# Altium schematic sheet Forced Oscillations ExperimentV2.SchDoc: Forced Oscillation Experiment
size A3; PageSetup: Record=PageOptions|CenterHorizontal=True|CenterVertical=True|PrintScale=0.95|XCorrection=1.00|YCorrection=1.00|PrintKind=0|BorderSize=5000000|LeftOffset=0|BottomOffset=0|Orientation=2|PaperLength=1000|PaperWidth=1000|Scale=100|PaperSource=7|PrintQuality=-3|MediaType=1|DitherType=10|PrintScaleMode=1|PaperKind=11×17|PaperIndex=17; Organization: Electronics Section; Address1: The University of Manchester; Address2: School of Chemistry; Address3: Tel. 0161 275 4641; Address4: RM 2.318; Revision: 3; SheetNumber: 1; SheetTotal: 2; FR: 1260; JobNo: 3266
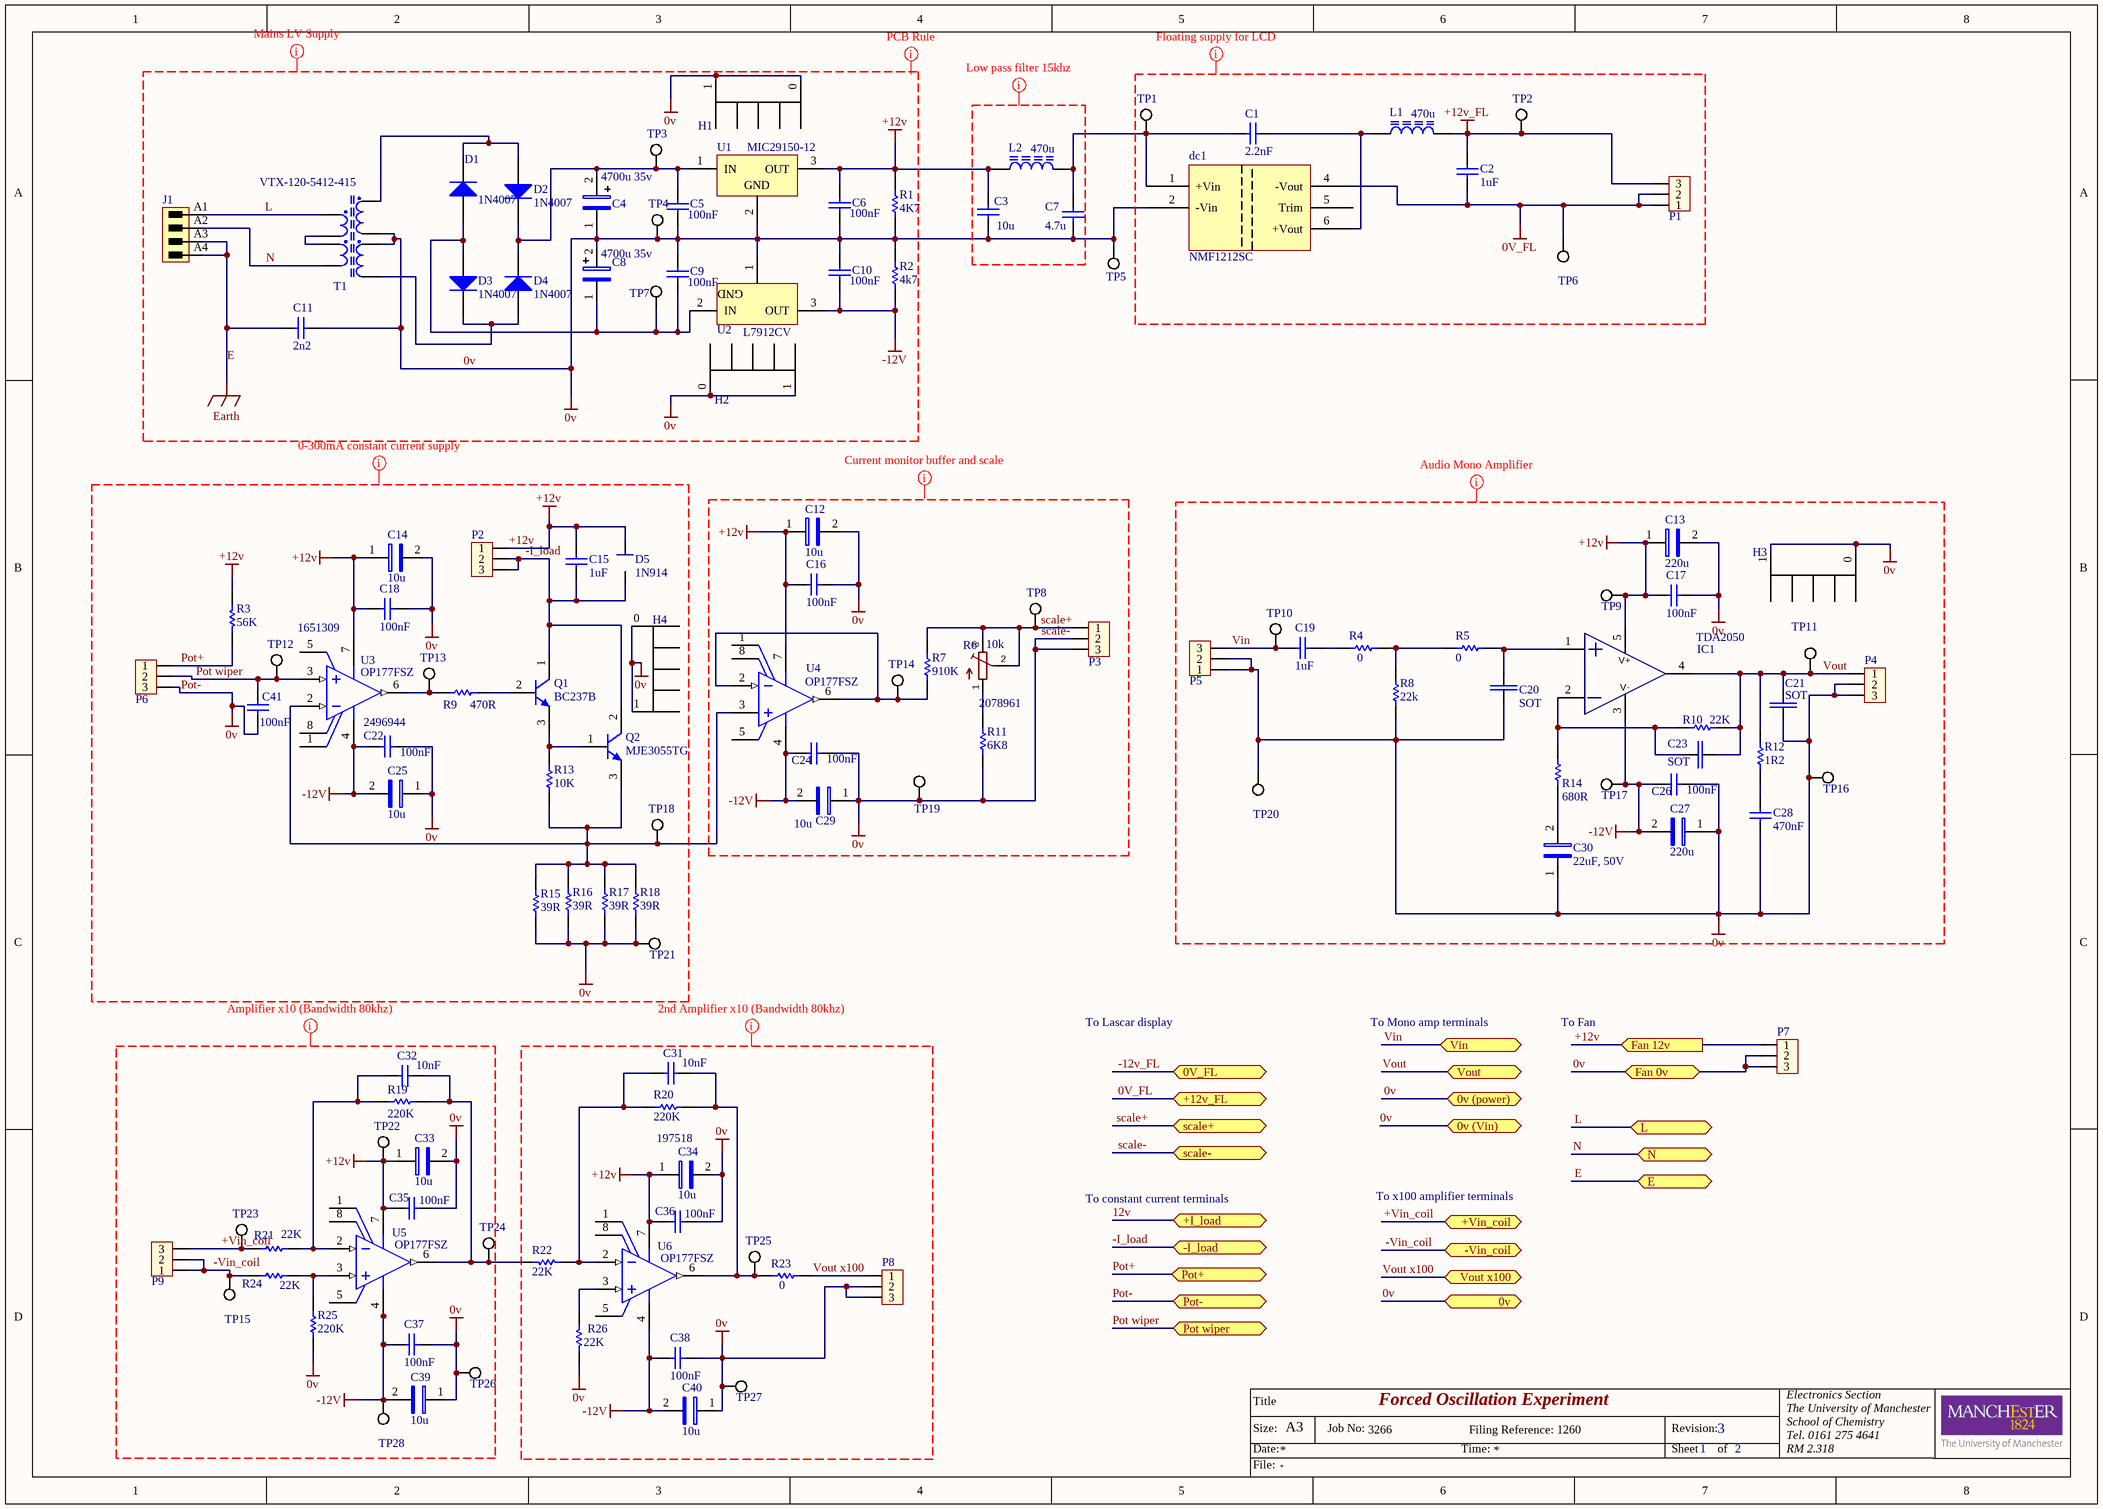
[diagram p0: Forced Oscillations ExperimentV2.SchDoc]

## Parts
C1  2.2nF  [CAPC0805(2012)100_N]
C2  1uF  [CAPC0805(2012)100_N]
C3  10u  [CAPC0805(2012)145_L]
C4  4700u 35v  [MCLPR_35v]
C5  100nF  [CAPC0805(2012)100_M]
C6  100nF  [CAPC0805(2012)100_M]
C7  4.7u  [CAPC0805(2012)145_L]
C8  4700u 35v  [MCLPR_35v]
C9  100nF  [CAPC0805(2012)100_M]
C10  100nF  [CAPC0805(2012)100_M]
C11  2n2  [RAD-0.3]
C12  value 10u  [Cap_pol_2312_6032]  (hidden comment: Tant_2312_6032)
C13  220u  [Electrolytic size F]
C14  value 10u  [Cap_pol_2312_6032]  (hidden comment: Tant_2312_6032)
C15  1uF  [CAPC0805(2012)100_N]
C16  100nF  [CAPC0805(2012)100_M]
C17  100nF  [CAPC0805(2012)100_M]
C18  100nF  [CAPC0805(2012)100_M]
C19  1uF  [CAPC0805(2012)100_N]
C20  SOT  [SOT_ceramic_0805]
C21  SOT  [SOT_ceramic_0805]
C22  Supplier Part Number 1: 2496944  [CAPC0805(2012)100_M]  (hidden comment: 100nF)
C23  SOT  [SOT_ceramic_0805]
C24  100nF  [CAPC0805(2012)100_M]
C25  value 10u  [Cap_pol_2312_6032]  (hidden comment: Tant_2312_6032)
C26  100nF  [CAPC0805(2012)100_M]
C27  220u  [Electrolytic size F]
C28  470nF  [CAPC0805(2012)100_N]
C29  value 10u  [Cap_pol_2312_6032]  (hidden comment: Tant_2312_6032)
C30  22uF, 50V  [PANASONIC, Size D]
C31  10nF  [CAPC0805(2012)100_L]
C32  10nF  [CAPC0805(2012)100_L]
C33  value 10u  [Cap_pol_2312_6032]  (hidden comment: Tant_2312_6032)
C34  value 10u  Supplier Part Number 1: 197518  [Cap_pol_2312_6032]  (hidden comment: Tant_2312_6032)
C35  100nF  [CAPC0805(2012)100_M]
C36  100nF  [CAPC0805(2012)100_M]
C37  100nF  [CAPC0805(2012)100_M]
C38  100nF  [CAPC0805(2012)100_M]
C39  value 10u  [Cap_pol_2312_6032]  (hidden comment: Tant_2312_6032)
C40  value 10u  [Cap_pol_2312_6032]  (hidden comment: Tant_2312_6032)
C41  100nF  [CAPC0805(2012)100_M]
D1  1N4007  [DO-41]
D2  1N4007  [DO-41]
D3  1N4007  [DO-41]
D4  1N4007  [DO-41]
D5  1N914  [RB551V-30TE-17]
dc1  NMF1212SC  [NMFXXXXSC]
H1  sk 76 50 sts to 220  [sk76-50-to220]  (value not drawn)
H2  sk 76 50 sts to 220  [sk76-50-to220]  (value not drawn)
H3  Heatsink 2  [1.25gy-50]  (value not drawn)
H4  sk 76 50 sts to 220  [sk76-50-to220]  (value not drawn)
IC1  TDA2050  [TDA2050_Vertical_Pentawatt]
J1  1147360000  [SL_5_08HC_180B_04]  (value not drawn)
L1  470u  [Multi-Size]
L2  470u  [Multi-Size]
P1  Molex KK 0.1  3pin  [Molex KK 0.1 3pin]  (value not drawn)
P2  Molex KK 0.1  3pin  [Molex KK 0.1 3pin]  (value not drawn)
P3  Molex KK 0.1  3pin  [Molex KK 0.1 3pin]  (value not drawn)
P4  Molex KK 0.1  3pin  [Molex KK 0.1 3pin]  (value not drawn)
P5  Molex KK 0.1  3pin  [Molex KK 0.1 3pin]  (value not drawn)
P6  Molex KK 0.1  3pin  [Molex KK 0.1 3pin]  (value not drawn)
P7  Molex KK 0.1  3pin  [Molex KK 0.1 3pin]  (value not drawn)
P8  Molex KK 0.1  3pin  [Molex KK 0.1 3pin]  (value not drawn)
P9  Molex KK 0.1  3pin  [Molex KK 0.1 3pin]  (value not drawn)
Q1  BC237B  [ONSC-TO-92-3-29-11]
Q2  MJE3055TG  [ONSC-TO-220-3-221A-09]
R1  4K7  [RESC0805(2012)_M]
R2  4k7  [RESC0805(2012)_M]
R3  56K  [RESC0805(2012)_L]
R4  0  [RESC0805(2012)_N]
R5  0  [RESC0805(2012)_N]
R6  10k  [3269w]
R7  910K  [RESC0805(2012)_L]
R8  22k  [RESC0805(2012)_N]
R9  470R  [RESC0805(2012)_M]
R10  22K  [RESC0805(2012)_N]
R11  6K8  Supplier Part Number 1: 2078961  [RESC0805(2012)_L]
R12  1R2  [RESC2512(6432)_M]
R13  10K  [RESC0805(2012)_M]
R14  680R  [RESC0805(2012)_L]
R15  39R  [RESC2512(6432)_M]
R16  39R  [RESC2512(6432)_M]
R17  39R  [RESC2512(6432)_M]
R18  39R  [RESC2512(6432)_M]
R19  220K  [RESC0805(2012)_N]
R20  220K  [RESC0805(2012)_N]
R21  22K  [RESC0805(2012)_N]
R22  22K  [RESC0805(2012)_N]
R23  0  [RESC0805(2012)_N]
R24  22K  [RESC0805(2012)_N]
R25  220K  [RESC0805(2012)_N]
R26  22K  [RESC0805(2012)_N]
T1  VTX-120-5412-415  [VTX-120-5412-415]
TP1  Test Point  [S1751-46R]  (value not drawn)
TP2  Test Point  [S1751-46R]  (value not drawn)
TP3  Test Point  [S1751-46R]  (value not drawn)
TP4  Test Point  [S1751-46R]  (value not drawn)
TP5  Test Point  [S1751-46R]  (value not drawn)
TP6  Test Point  [S1751-46R]  (value not drawn)
TP7  Test Point  [S1751-46R]  (value not drawn)
TP8  Test Point  [S1751-46R]  (value not drawn)
TP9  Test Point  [S1751-46R]  (value not drawn)
TP10  Test Point  [S1751-46R]  (value not drawn)
TP11  Test Point  [S1751-46R]  (value not drawn)
TP12  Test Point  [S1751-46R]  (value not drawn)
TP13  Test Point  [S1751-46R]  (value not drawn)
TP14  Test Point  [S1751-46R]  (value not drawn)
TP15  Test Point  [S1751-46R]  (value not drawn)
TP16  Test Point  [S1751-46R]  (value not drawn)
TP17  Test Point  [S1751-46R]  (value not drawn)
TP18  Test Point  [S1751-46R]  (value not drawn)
TP19  Test Point  [S1751-46R]  (value not drawn)
TP20  Test Point  [S1751-46R]  (value not drawn)
TP21  Test Point  [S1751-46R]  (value not drawn)
TP22  Test Point  [S1751-46R]  (value not drawn)
TP23  Test Point  [S1751-46R]  (value not drawn)
TP24  Test Point  [S1751-46R]  (value not drawn)
TP25  Test Point  [S1751-46R]  (value not drawn)
TP26  Test Point  [S1751-46R]  (value not drawn)
TP27  Test Point  [S1751-46R]  (value not drawn)
TP28  Test Point  [S1751-46R]  (value not drawn)
U1  MIC29150-12  [TO220]
U2  L7912CV  [TO-220]
U3  OP177FSZ  Supplier Part Number 1: 1651309  [ADI-R-8_N]
U4  OP177FSZ  [ADI-R-8_N]
U5  OP177FSZ  [ADI-R-8_N]
U6  OP177FSZ  [ADI-R-8_N]

## Ports
0v, 0v (power) (bidir), 0v (Vin) (bidir), 0V_FL (bidir), +12v_FL (bidir), +I_load, +Vin_coil, -I_load, -Vin_coil, E (bidir), Fan 0v (bidir), Fan 12v (in), L (bidir), N (bidir), Pot wiper, Pot+, Pot-, scale+ (bidir), scale- (bidir), Vin (bidir), Vout (bidir), Vout x100

## Nets
0v: C3.2 C4.1 C5.2 C6.2 C7.2 C8.2 C9.1 C10.1 C11.2 C12.2 C13.2 C14.2 C16.1 C17.1 C18.1 C20.1 C21.1 C22.1 C24.1 C25.1 C26.1 C27.1 C28.2 C29.1 C30.1 C33.2 C34.2 C35.1 C36.1 C37.1 C38.1 C39.1 C40.1 C41.2 dc1.2(-Vin) H1.0 H1.1 H2.0 H2.1 H3.0 H3.1 H4.0 H4.1 P3.2 P3.3 P4.2 P4.3 P5.1 P5.2 P6.3 P7.2 P7.3 P8.2 P8.3 R1.2 R2.1 R8.2 R11.1 R15.2 R16.2 R17.2 R18.2 R25.2 R26.1 T1.6 T1.7 TP4.1 TP5.1 TP16.1 TP19.1 TP20.1 TP21.1 TP26.1 TP27.1 U1.2(GND) U2.1(GND) ; port 0v, port scale-, port Pot-, port 0v (power), port 0v (Vin), port Fan 0v  [also labelled Pot-, scale-]
0V_FL: C2.2 dc1.4(-Vout) P1.1 P1.2 TP6.1 ; port +12v_FL
+12v: C3.1 C6.1 C12.1 C13.1 C14.1 C15.1 C16.2 C17.2 C18.2 C33.1 C34.1 C35.2 C36.2 D5.1 IC1.5(VCC) L2.1 P2.1 P7.1 R1.1 R3.2 TP9.1 TP22.1 U1.3(OUT) U3.7(V+) U4.7(V+) U5.7(V+) U6.7(V+) ; port Fan 12v
+12v_FL: C2.1 L1.2 P1.3 TP2.1
-12V: C10.2 C22.2 C24.2 C25.2 C26.2 C27.2 C29.2 C37.2 C38.2 C39.2 C40.2 IC1.3(V-) R2.2 TP17.1 TP28.1 U2.3(OUT) U3.4(V-) U4.4(V-) U5.4(V-) U6.4(V-)
E: C11.1 J1.A3 J1.A4 ; port E  [also labelled Earth]
12v: port +I_load
+Vin_coil: P9.3 R21.1 TP23.1 ; port +Vin_coil
-12v_FL: port 0V_FL
-I_load: C15.2 D5.2 P2.2 P2.3 Q1.1(C) Q2.2(C) ; port -I_load
-Vin_coil: P9.1 P9.2 R24.1 TP15.1 ; port -Vin_coil
L: J1.A1 T1.1(0v) ; port L
N: J1.A2 T1.4 ; port N
Pot wiper: C41.1 P6.2 TP12.1 U3.3(+IN) ; port Pot wiper
Pot+: P6.1 R3.1 ; port Pot+
scale+: P3.1 R6.2(S) R6.3(E) R7.1 TP8.1 ; port scale+
Vin: C19.1 P5.3 TP10.1 ; port Vin
Vout: C21.2 C23.2 IC1.4(OUT) P4.1 R10.2 R12.2 TP11.1 ; port Vout
Vout x100: P8.1 R23.2 ; port Vout x100
NetC1_1: C1.1 C7.1 dc1.1(+Vin) L2.2 TP1.1
NetC1_2: C1.2 dc1.6(+Vout) L1.1
NetC4_2: C4.2 C5.1 D2.2(K) D4.2(K) TP3.1 U1.1(IN)
NetC8_1: C8.1 C9.2 D1.1(A) D3.1(A) TP7.1 U2.2(IN)
NetC19_2: C19.2 R4.1
NetC20_2: C20.2 IC1.1(IN+) R5.2
NetC23_1: C23.1 IC1.2(IN-) R10.1 R14.1
NetC28_1: C28.1 R12.1
NetC30_2: C30.2 R14.2
NetC31_1: C31.1 R20.2 R22.2 U6.2(-IN)
NetC31_2: C31.2 R20.1 R23.1 TP25.1 U6.6(OUT)
NetC32_1: C32.1 R19.2 R21.2 U5.2(-IN)
NetC32_2: C32.2 R19.1 R22.1 TP24.1 U5.6(OUT)
NetD1_2: D1.2(K) D2.1(A) T1.5
NetD3_2: D3.2(K) D4.1(A) T1.8
NetQ1_2: Q1.2(B) R9.2
NetQ1_3: Q1.3(E) Q2.1(B) R13.1
NetQ2_3: Q2.3(E) R13.2 R15.1 R16.1 R17.1 R18.1 TP18.1 U3.2(-IN) U4.3(+IN)
NetR4_2: R4.2 R5.1 R8.1
NetR6_1: R6.1(A) R11.2
NetR7_2: R7.2 TP14.1 U4.2(-IN) U4.6(OUT)
NetR9_1: R9.1 TP13.1 U3.6(OUT)
NetR24_2: R24.2 R25.1 U5.3(+IN)
NetR26_2: R26.2 U6.3(+IN)
NetT1_2: T1.2(Vpri) T1.3

Not connected (* = marked no-connect by the designer): dc1 5(Trim); U3 1(VOS_TRIM) 5(NC) 8(VOS_TRIM); U4 1(VOS_TRIM) 5(NC) 8(VOS_TRIM); U5 1(VOS_TRIM) 5(NC) 8(VOS_TRIM); U6 1(VOS_TRIM) 5(NC) 8(VOS_TRIM)

## Layout directives
net class Low pass filter 15khz: (no net found under the mark)
net class Undefined: 0V_FL, +12v_FL
net class Constant current Supply: 0v, +12v, -12V, -I_load, Pot wiper, Pot+, Pot-
net class Current buffer: 0v, +12v, -12V, scale+, scale-
net class x100 amplifier (1): 0v, +12v, +Vin_coil, -12V, -Vin_coil
net class x100 amp (2): 0v, +12v, -12V, Vout x100
net class Mono Amplifier: 0v, +12v, -12V, Vin, Vout
net class Mains LV: 0v, +12v, -12V, E, Earth, L, N
rule Width Constraint [Pref Width = 4mm    Min Width = 0.5mm    Max Width = 5mm]: 0v, +12v, -12V, E, Earth, L, N

## Notes on the sheet
- To Lascar display
- To Mono amp terminals
- To Fan
- To constant current terminals
- To x100 amplifier terminals
- Title
- Size:
- Date:
- A3
- Job No:
- Time:
- Filing Reference:
- Revision:
- Sheet
- of
- File:
- (in symbol TDA2050) V+

## Library data of the parts
C1 = CMP-1036-03249-1: CAP 2.2nF 25V ±1% 0805 (2012 Metric) Thickness 1mm SMD; Case-EIA: 0805; Case-Metric: 2012; Tolerance: Â±1%; Rated Voltage: 25 V; Technology: SMT; Max Thickness: 1 mm; Value: 2.2nF; ClassName: Floating supply; Supplier 1: Farnell; Supplier Part Number 1: 2280664
C2 C15 C19 = CMP-1036-04756-1: CAP 1uF 25V ±20% 0805 (2012 Metric) Thickness 1mm SMD; Case-Metric: 2012; Case-EIA: 0805; Tolerance: Â±20%; Max Thickness: 1 mm; Technology: SMT; Value: 1uF; Rated Voltage: 25 V; Supplier 1: Farnell; Supplier Part Number 1: 2496944
  C2 C15: ClassName: Constant current
  C19: ClassName: Power Amp
C3 = CMP-1036-04703-1: Case-EIA: 0805; Tolerance: Â±5%; Value: 10uf; Rated Voltage: 50 V; Case-Metric: 2012; Technology: SMT; Max Thickness: 1.45 mm; ClassName: lowpass filter; Supplier 1: Farnell; Supplier Part Number 1: 1867958
C4 C8 = MCLPR35V478M22x30: Supplier 1: Farnell; Supplier Part Number 1: 9452842; ClassName: Mains LV Supply
C5 C6 C9 C10 C16 C18 C22 C24 C26 C35-C38 C41 = CMP-1036-04409-1: Case-EIA: 0805; Case-Metric: 2012; Rated Voltage: 25 V; Tolerance: Â±5%; 2496944: Farnell; Max Thickness: 1 mm; Value: 100nF; Technology: SMT; Supplier 1: Farnell
  C5 C6 C9 C10: ClassName: Mains LV Supply; Supplier Part Number 1: 2496944
  C16 C24: ClassName: LCD Buffer; Supplier Part Number 1: 2496944
  C18: ClassName: Constant current; Supplier Part Number 1: 2496944
  C22: ClassName: Constant current
  C26: ClassName: Power Amp; Supplier Part Number 1: 2496944
  C35 C37 C41: ClassName: stage 1 amp; Supplier Part Number 1: 2496944
  C36 C38: ClassName: Stage 2 amp; Supplier Part Number 1: 2496944
C7 = CMP-1036-04703-1: Case-EIA: 0805; Tolerance: Â±5%; Value: 4.7uf; Rated Voltage: 50 V; Case-Metric: 2012; Technology: SMT; Max Thickness: 1.45 mm; ClassName: lowpass filter; Supplier 1: Farnell; Supplier Part Number 1: 2672194
C11 = Cap: Capacitor; Published: 8-Jun-2000; LatestRevisionDate: 17-Jul-2002; LatestRevisionNote: Re-released for DXP Platform.; PackageReference: RAD-0.3; Publisher: Altium Limited; PackageDescription: Radial Cap, Thru-Hole; 2 Leads; 0.3 in Pin Spacing; Supplier 1: Farnell; Supplier Part Number 1: 1609515
C13 C27 = Panasonic_size F8: Supplier 1: Farnell; Supplier Part Number 1: 2326216; ClassName: Power Amp
C17 = CMP-1036-04409-1: Case-EIA: 0805; Case-Metric: 2012; Rated Voltage: 100V; Tolerance: Â±5%; 2496944: Farnell; Max Thickness: 1 mm; Value: 100nF; Technology: SMT; ClassName: Power Amp; Supplier 1: Farnell; Supplier Part Number 1: 2496944
C20 C21 C23 = SOT_Ceramic: Value: SOT
C28 = CMP-1036-04644-1: CAP 470nF; Case-EIA: 0805; Tolerance: Â±5%; Rated Voltage: 25 V; Case-Metric: 2012; Value: 470nF; Technology: SMT; Max Thickness: 1 mm; ClassName: Power Amp; Supplier 1: Farnell; Supplier Part Number 1: 1288281
C30 = 22uF_50V: Supplier 1: Farnell; Supplier Part Number 1: 2326151
C31 C32 = CMP-1036-03826-1: CAP 10nF 25V ±2% 0805 (2012 Metric) Thickness 1mm SMD; Tolerance: Â±2%; Case-EIA: 0805; Case-Metric: 2012; Technology: SMT; Value: 10nF; Max Thickness: 1 mm; Supplier 1: Farnell; Supplier Part Number 1: 1869066
  C31: ClassName: Stage 2 amp
  C32: ClassName: stage 1 amp
D1 D3 D4 = Diode 1N4007: 1 Amp General Purpose Rectifier; Published: 8-Jun-2000; LatestRevisionDate: 17-Jul-2002; LatestRevisionNote: Re-released for DXP Platform.; DatasheetVersion: 1998; PackageVersion: Aug-1999; PackageReference: DO-41; Publisher: Altium Limited; PackageDescription: Diode, Axial; Body 5.2 x 2.7 mm (LxDia. max), Lead Dia. 0.86 mm (max); Code_JEDEC: DO-204-AL; ComponentLink1Description: Manufacturer Link; ComponentLink1URL: http://www.fairchildsemi.com/; ComponentLink2Description: Datasheet; ComponentLink2URL: http://www.fairchildsemi.com/ds/1N%2F1N4001.pdf; Supplier 1: Farnell; Supplier Part Number 1: 1843698
D2 = Diode 1N4007: 1 Amp General Purpose Rectifier; 1843698: Supplier Part Number 1; Published: 8-Jun-2000; LatestRevisionDate: 17-Jul-2002; LatestRevisionNote: Re-released for DXP Platform.; DatasheetVersion: 1998; PackageVersion: Aug-1999; PackageReference: DO-41; Publisher: Altium Limited; PackageDescription: Diode, Axial; Body 5.2 x 2.7 mm (LxDia. max), Lead Dia. 0.86 mm (max); Code_JEDEC: DO-204-AL; ComponentLink1Description: Manufacturer Link; ComponentLink1URL: http://www.fairchildsemi.com/; ComponentLink2Description: Datasheet; ComponentLink2URL: http://www.fairchildsemi.com/ds/1N%2F1N4001.pdf; Farnell: Supplier 1; Supplier 1: Farnell; Supplier Part Number 1: 1843698
D5 = RB551V-30TE-17: Small Signal Schottky Diode, Single, 30 V, 500 mA, 470 mV, 2 A; ClassName: Constant current; Supplier 1: Farnell; Supplier Part Number 1: 2453274
dc1 = NMFXXXXSC: ClassName: Floating supply; Supplier 1: Farnell; Supplier Part Number 1: 1021478
H1 = sk 76 50 sts to 220: RS: Supplier 1; Stock no: RS 221-2182; Supplier Part Number 1: 221-2182; Supplier 1: RS
H3 = 1.25gy-50: Supplier 1: Farnell; Supplier Part Number 1: 175009
H4 = sk 76 50 sts to 220: Suppler 1: RS; Stock no: RS 221-2182; Supplier Part Numner 1: 221-2182
J1 = CMP-1559-00994-1: OMNIMATE Signal - series BL/SL 5.08; Manufacturer: Weidmueller; Pitch_inch: 0.2 inch; Pitch_mm: 5.08 mm; Contact_material: Cu-Leg; UL_94_flammability_rating: V-0; Rated_current_use_group_B_UL_1059: 16 A; Mounting_onto_the_PCB: Solder connection; Contact_surface: tinned; Outgoing_elbow: 180°; Insulating_material: PA GF; Short_text_for_material: SL 5.08HC/04/180B 3.2SN OR BX; Solder_pin_length_mm: 3.2 mm; No_of_poles: 4; Rated_voltage_for_surge_voltage_class_pollution_degree_II_2: 400 V; Side_termination_characteristic: Dovetails for fixing blocks; Rated_voltage_use_group_B_UL_1059: 300 V; PartNumber: 1147360000; PackageReference: SL_5_08HC_180B_04; ComponentLink1Description: Manufacturer URL; Colour: Orange; ComponentLink2Description: URL Link1; Revision: V1; ComponentLink2URL: http://catalog.weidmueller.com/catalog/Start.do?localeId=en&ObjectID=1147360000; ComponentLink1URL: http://www.weidmueller.com/; Packaging: Box; Qty: 100 PCS; ClassName: Mains LV Supply; Supplier 1: Farnell; Supplier Part Number 1: 1866502
L1 L2 = Multi-Inductor: ELL8TP100MB, IHLP1212BZER2R2M11, B82472P6102M000
  L1: ClassName: Floating supply; Supplier 2: Farnell; Supplier Part Number 2: 1644583
  L2: ClassName: lowpass filter; Supplier 1: Farnell; Supplier Part Number 1: 1644583
Q1 = CMP-1048-01445-1: Amplifier Transistor, NPN Silicon, 3-Pin TO-92, Bulk Box; Manufacturer: On Semiconductor; Note1: 0; IC Continuous (A): 0.1; Mounting Technology: Through Hole; ComponentLink2Description: Datasheet; ComponentLink1URL: http://www.onsemi.com/; ComponentLink2URL: http://www.onsemi.com/pub_link/Collateral/BC237-D.PDF; DatasheetVersion: Rev. 5; ComponentLink3URL: http://www.onsemi.cn/pub_link/Collateral/2N6426-D.PDF; Polarity: NPN; PartNumber: BC237B; PackageReference: TO-92-3-29-11_AM_SL; PackageDescription: 3-Pin Transistor Outline, Body 4.825 x 3.685 mm, Pitch 1.27 mm; ComponentLink3Description: Package Specification; Packing: Bulk Box; PackageVersion: Rev. AM; ComponentLink1Description: Manufacturer URL; RoHS: FALSE; ClassName: Constant current; Supplier 1: Farnell; Supplier Part Number 1: 1574377
Q2 = CMP-1048-00035-1: Complementary Silicon Plastic Power Transistor, 3-Pin TO-220, Pb-Free, Tube; Manufacturer: On Semiconductor; IC Continuous (A): 10; fT Min (MHz): 2; Polarity: NPN; ComponentLink3URL: http://www.onsemi.com/pub_link/Collateral/221A-09.PDF; ComponentLink2URL: http://www.onsemi.com/pub_link/Collateral/MJE2955T-D.PDF; ComponentLink3Description: Package Specification; DatasheetVersion: Rev. 11; PackageVersion: Rev. AG, 09/2011; PartNumber: MJE3055TG; RoHS: TRUE; PackageReference: TO-220-3-221A-09; ComponentLink2Description: Datasheet; Packing: Tube; Mounting Technology: Through Hole; PackageDescription: 3-Pin Flange Mount, Vertical Straight Lead, Body 9.97 x 4.445 mm, Pitch 2.54 mm; ComponentLink1URL: http://www.onsemi.com/; ComponentLink1Description: Manufacturer URL; ClassName: Constant current; Supplier 1: Farnell; Supplier Part Number 1: 9802452
R1 R2 = CMP-1013-00586-1: 4K7 0.125W 1% 0805 (2012 Metric)  SMD; Case-Metric: 2012; Case-EIA: 0805; Value: 4700.00 Ohm; Technology: SMT; Power: 0.125 W; Tolerance: 1 %; ClassName: Mains LV Supply; Supplier 1: Farnell; Supplier Part Number 1: 2447672
R3 = CMP-1013-00708-1: 56K 0.125W 1% 0805 (2012 Metric)  SMD; Case-Metric: 2012; Value: 56000.00 Ohm; Case-EIA: 0805; Tolerance: 1 %; Power: 0.125 W; Technology: SMT; ClassName: Constant current; Supplier 1: Farnell; Supplier Part Number 1: 2447687
R4 R5 R23 = CMP-1013-00001-1: Jumper 0805 (2012 Metric); Case-EIA: 0805; Value: 0.00 Ohm; Tolerance: None; Case-Metric: 2012; Technology: SMT; Power: None; ClassName: Power Amp
R6 = Bourns 3269w-10k: 10k surface mount pot verticle adjust; Supplier 1: Farnell; Supplier Part Number 1: 9352961
R7 = CMP-1013-00845-1: 910K 0.125W 1% 0805 (2012 Metric)  SMD; Case-Metric: 2012; Case-EIA: 0805; Value: 910000.00 Ohm; Tolerance: 1 %; Power: 0.125 W; Technology: SMT; ClassName: LCD Buffer; Supplier 1: Farnell; Supplier Part Number 1: 2447735
R8 R10 R21 R22 R24 R26 = CMP-1013-00659-1: 22K 0.125W 1% 0805 (2012 Metric)  SMD; Value: 22000.00 Ohm; Case-EIA: 0805; Case-Metric: 2012; Tolerance: 1 %; Technology: SMT; Power: 0.125 W; Supplier 1: Farnell; Supplier Part Number 1: 2447607
  R8 R10: ClassName: Power Amp
  R21 R24: ClassName: stage 1 amp
  R22 R26: ClassName: Stage 2 amp
R9 = CMP-1013-00473-1: 470R 0.125W 1% 0805 (2012 Metric)  SMD; Case-Metric: 2012; Value: 470.00 Ohm; Case-EIA: 0805; Power: 0.125 W; Technology: SMT; Tolerance: 1 %; ClassName: Constant current; Supplier 1: Farnell; Supplier Part Number 1: 2447662
R11 = CMP-1013-00094-1: 6K8 0.125W 5% 0805 (2012 Metric)  SMD; Case-EIA: 0805; Case-Metric: 2012; Value: 6800.00 Ohm; Technology: SMT; Tolerance: 5 %; Power: 0.125 W; Supplier 1: Farnell
R12 = CMP-1018-00004-1: 1R2 1W 5% 2512 (6432 Metric)  SMD; Case-EIA: 2512; Case-Metric: 6432; Value: 1.20 Ohm; Tolerance: 5 %; Power: 1 W; Technology: SMT; Supplier 1: Farnell; Supplier Part Number 1: 2476356
R13 = CMP-1013-00623-1: 10K 0.125W 1% 0805 (2012 Metric)  SMD; Value: 10000.00 Ohm; Case-Metric: 2012; Case-EIA: 0805; Tolerance: 1 %; Power: 0.125 W; Technology: SMT; ClassName: Constant current; Supplier 1: Farnell; Supplier Part Number 1: 2447553
R14 = CMP-1013-00491-1: 680R 0.125W 1% 0805 (2012 Metric)  SMD; Case-Metric: 2012; Case-EIA: 0805; Value: 680.00 Ohm; Tolerance: 1 %; Power: 0.125 W; Technology: SMT; ClassName: Power Amp; Supplier 1: Farnell; Supplier Part Number 1: 2447705
R15-R18 = CMP-1018-00040-1: 39R 1W 5% 2512 (6432 Metric)  SMD; Case-Metric: 6432; Value: 39.00 Ohm; Case-EIA: 2512; Power: 1 W; Tolerance: 5 %; Technology: SMT; ClassName: Constant current; Supplier 1: Farnell; Supplier Part Number 1: 2117466
R19 R20 R25 = CMP-1013-00772-1: 220K 0.125W 1% 0805 (2012 Metric)  SMD; Value: 220000.00 Ohm; Case-EIA: 0805; Case-Metric: 2012; Power: 0.125 W; Tolerance: 1 %; Technology: SMT; Supplier 1: Farnell; Supplier Part Number 1: 2074407
  R19 R25: ClassName: stage 1 amp
  R20: ClassName: Stage 2 amp
TP1-TP28 = S1751-46R: SMD Micro Test Point; Supplier 1: Farnell; Supplier 2: Farnell; Supplier 3: Farnell; Supplier Part Number 1: 2293786; Supplier Part Number 2: 1022338; Supplier Part Number 3: 2411184
  TP1 TP2 TP5 TP6: ClassName: Floating supply
  TP3 TP4 TP7: ClassName: Mains LV Supply
  TP8 TP14 TP15 TP19: ClassName: LCD Buffer
  TP9-TP11 TP16 TP17 TP20: ClassName: Power Amp
  TP12 TP13 TP18 TP21: ClassName: Constant current
  TP22-TP24 TP26 TP28: ClassName: stage 1 amp
  TP25 TP27: ClassName: Stage 2 amp
U1 = CMP-0244-00450-1: Positive Voltage Regulator, 12V, 1.5a_3-Pin TO-220; PackageDescription: TO, Thru-Hole, Vertical, Heatsink Mounted; 3 In-Line Leads; Pitch 2.54 mm; ComponentLink3URL: http://www.st.com/internet/com/TECHNICAL_RESOURCES/TECHNICAL_LITERATURE/PACKAGE_INFORMATION/CD00004649.pdf; ComponentLink1URL: http://www.st.com; ComponentLink2Description: Datasheet; ComponentLink3Description: Package Specification; ComponentLink2URL: http://www.st.com/internet/com/TECHNICAL_RESOURCES/TECHNICAL_LITERATURE/DATASHEET/CD00000444.pdf; DatasheetVersion: 16/11/2011; PackageVersion: ver3.0; PackageReference: TO220; ComponentLink1Description: Manufacturer URL; ClassName: Mains LV Supply; Supplier 1: Farnell; Supplier Part Number 1: 2509998; Supplier 2: Farnell; Supplier Part Number 2: 2431736
U2 = CMP-0244-00457-1: Negative Voltage Regulator, -12V, 3-Pin TO-220; PackageReference: TO-220; PackageVersion: 2011; PackageDescription: TO, Thru-Hole, Vertical, Heatsink Mounted; 3 In-Line Leads; Pitch 2.54 mm; ComponentLink1Description: Manufacturer URL; ComponentLink2URL: http://www.st.com/internet/com/TECHNICAL_RESOURCES/TECHNICAL_LITERATURE/DATASHEET/CD00000450.pdf; ComponentLink2Description: Datasheet; ComponentLink1URL: http://www.st.com; DatasheetVersion: 1/11/2011; ClassName: Mains LV Supply; Supplier 1: Farnell; Supplier Part Number 1: 1095391
U3-U6 = CMP-0384-01262-2: Single Channel Ultra Low Offset Voltage Operational Amplifier, 600 KHz BW, 300 mV/us SR, Industrial, 8-pin SOIC (R-8), Tube; Generic Part Number: OP177; Manufacturer: Analog Devices; Input Bias Current: 1.2nA; V Span Min: 6V; Amplifiers Per Package: 1; Input Offset Voltage: 10uV; V Span Max: 44V; Iq/Amp: 2mA; Small Signal Bandwidth: 600KHz; Mounting Technology: Surface Mount; ComponentLink2URL: http://www.analog.com/static/imported-files/data_sheets/OP177.pdf; RevisionNote: Reference Circuit URL fixed; ComponentLink1URL: http://www.analog.com/en/index.html; ComponentLink3URL: http://www.analog.com/static/imported-files/packages/PKG_PDF/SOIC_Narrow%20(R)/R_8.pdf; Packing: Tube; PackageVersion: 060506-A; PackageDescription: 8-Pin Standard Small Outline Package, Body 3.9 x 4.9 mm, Pitch 1.27 mm; Slew Rate: 300mV/us; PartNumber: OP177FSZ; DatasheetVersion: Rev. G; ComponentLink3Description: Package Specification; Code_JEDEC: MS-012-AA; PackageReference: R-8; ComponentLink4Description: Reference Circuit; ComponentLink2Description: Datasheet; ComponentLink1Description: Manufacturer URL; ComponentLink4URL: http://www.analog.com/en/all-operational-amplifiers-op-amps/operational-amplifiers-op-amps/op177/products/product.html#product-recommendations; Supplier 1: Farnell
  U3: ClassName: Constant current
  U4: ClassName: LCD Buffer; Supplier Part Number 1: 1651309
  U5: ClassName: stage 1 amp; Supplier Part Number 1: 1651309
  U6: ClassName: Stage 2 amp; Supplier Part Number 1: 1651309
C12 C14 C25 C29 C33 C34 C39 C40 = Tant_2312_6032: Supplier 1: Farnell
  C12 C29: ClassName: LCD Buffer; Supplier Part Number 1: 197518
  C14: ClassName: Constant current; Farnell: Supplier; Supplier Part Number 1: 197518
  C25: ClassName: Constant current; Supplier Part Number 1: 197518
  C33 C39: ClassName: stage 1 amp; Supplier Part Number 1: 197518
  C34: ClassName: Stage 2 amp
  C40: ClassName: Stage 2 amp; Supplier Part Number 1: 197518
H2 = sk 76 50 sts to 220: Stock no: RS 221-2182; Supplier 1: RS; Supplier Part Number 1: 221-2182
IC1 = TDA2050: Supplier 1: Farnell; Supplier Part Number 1: 1094345
P1-P9 = Molex KK 0.1  3pin: Supplier 1: Farnell; Supplier Part Number 1: 1462838
T1 = VTX-120-5412-415: Supplier 1: Farnell; Supplier Part Number 1: 1712723; ClassName: Mains LV Supply